# Altium project ATSAMR34 v.1.1.PrjPcb
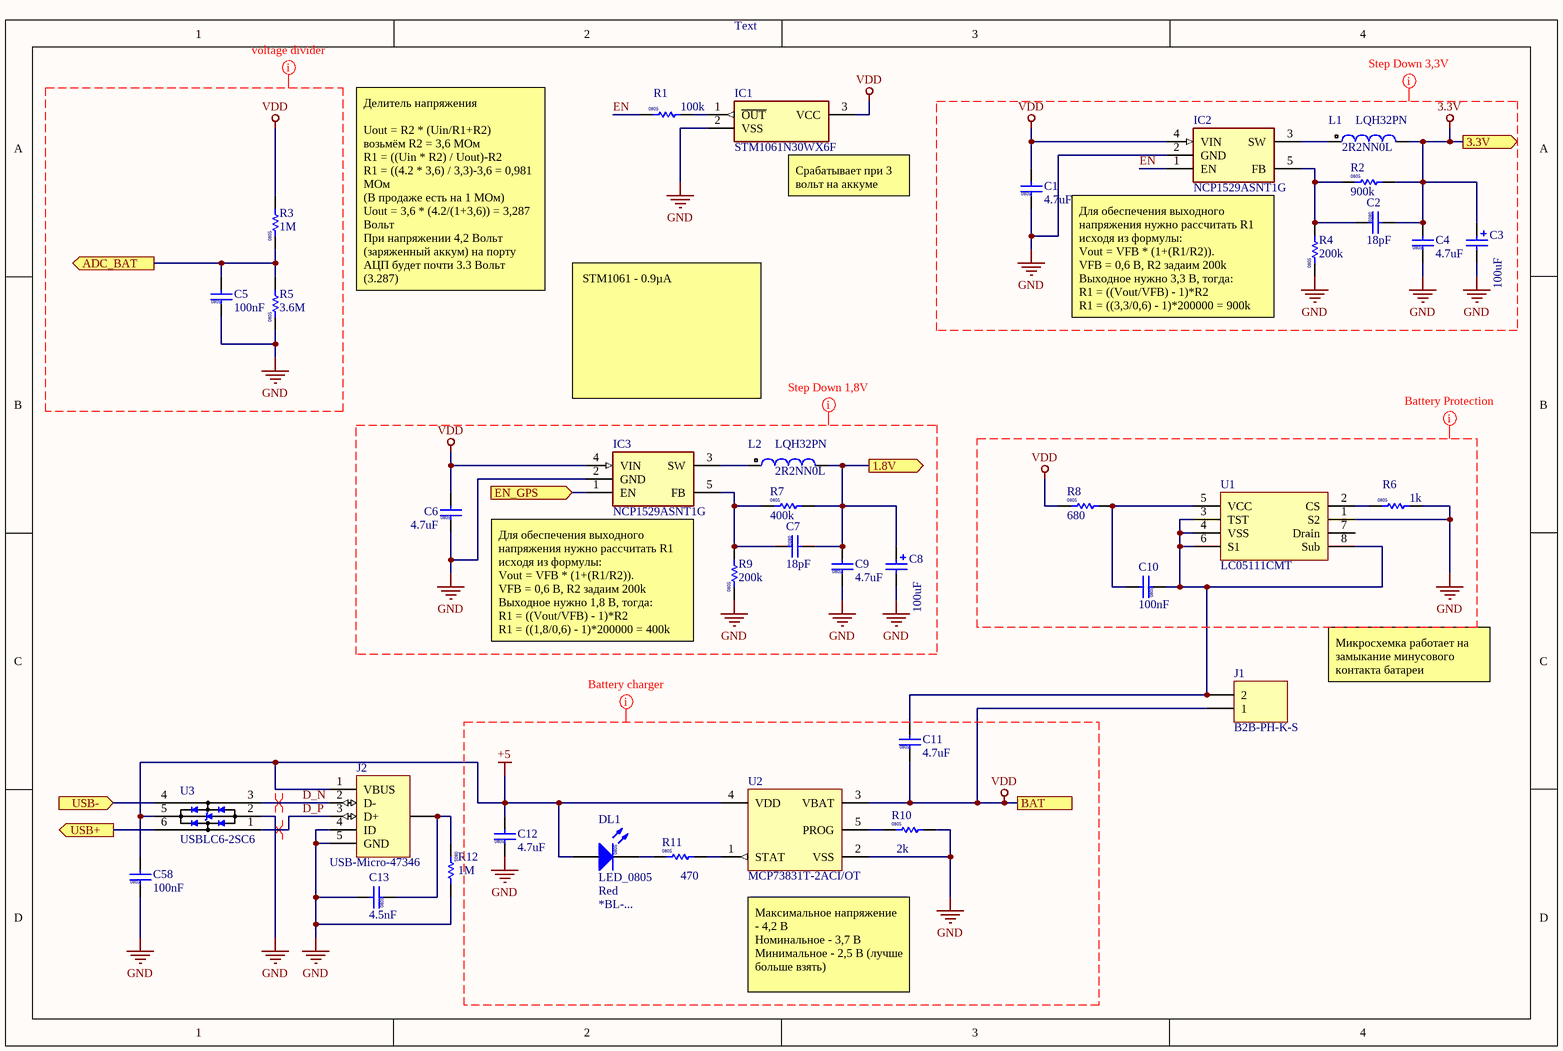
[diagram p0: Battery_Control.SchDoc]
3 sheets, 137 parts. Net scope: flat (ports and power ports of the same name join across sheets).
Board file: Lora_Geiger_PCB.PcbDoc
Sheets:
  Battery_Control.SchDoc
  MCU_RF.SchDoc
  Geiger_Pwr_LM3478.SchDoc

## Sheet Battery_Control.SchDoc
size A4

### Parts
C1  value 4.7uF  [CAPC2012-0805M]  (hidden comment: CAPC_0805)
C2  value 18pF  [CAPC2012-0805M]  (hidden comment: CAPC_0805)
C3  value 100uF  [ECAPC_0505]  (hidden comment: ECAPC_0505)
C4  value 4.7uF  [CAPC2012-0805M]  (hidden comment: CAPC_0805)
C5  value 100nF  [CAPC2012-0805M]  (hidden comment: CAPC_0805)
C6  value 4.7uF  [CAPC2012-0805M]  (hidden comment: CAPC_0805)
C7  value 18pF  [CAPC2012-0805M]  (hidden comment: CAPC_0805)
C8  value 100uF  [ECAPC_0505]  (hidden comment: ECAPC_0505)
C9  value 4.7uF  [CAPC2012-0805M]  (hidden comment: CAPC_0805)
C10  value 100nF  [CAPC2012-0805M]  (hidden comment: CAPC_0805)
C11  value 4.7uF  [CAPC2012-0805M]  (hidden comment: CAPC_0805)
C12  value 4.7uF  [CAPC2012-0805M]  (hidden comment: CAPC_0805)
C13  value 4.5nF  [CAPC2012-0805M]  (hidden comment: CAPC_0805)
C58  value 100nF  [CAPC2012-0805M]  (hidden comment: CAPC_0805)
DL1  LED_0805  Color: Red  Part number: *BL-...  [DIODEC2012-0805]
IC1  STM1061N30WX6F  [SOT103P237X112-3N]
IC2  NCP1529ASNT1G  [SOT95P275X110-5N]
IC3  NCP1529ASNT1G  [SOT95P275X110-5N]
J1  B2B-PH-K-S  [B2B-PH-K-S]
J2  USB-Micro-47346  [USB_micro_B]
L1  LQH32PN  value 2R2NN0L  [LQH32PN_N]
L2  LQH32PN  value 2R2NN0L  [LQH32PN_N]
R1  value 100k  [RESC2012-0805M]  (hidden comment: RESC_0805)
R2  value 900k  [RESC2012-0805M]  (hidden comment: RESC_0805)
R3  value 1M  [RESC2012-0805M]  (hidden comment: RESC_0805)
R4  value 200k  [RESC2012-0805M]  (hidden comment: RESC_0805)
R5  value 3.6M  [RESC2012-0805M]  (hidden comment: RESC_0805)
R6  value 1k  [RESC2012-0805M]  (hidden comment: RESC_0805)
R7  value 400k  [RESC2012-0805M]  (hidden comment: RESC_0805)
R8  value 680  [RESC2012-0805M]  (hidden comment: RESC_0805)
R9  value 200k  [RESC2012-0805M]  (hidden comment: RESC_0805)
R10  value 2k  [RESC2012-0805M]  (hidden comment: RESC_0805)
R11  value 470  [RESC2012-0805M]  (hidden comment: RESC_0805)
R12  value 1M  [RESC2012-0805M]  (hidden comment: RESC_0805)
U1  LC05111CMT  [WDFN6 2.6x4.0, 0.65P]
U2  MCP73831T-2ACI/OT  [SOT-23-OT5_N]
U3  USBLC6-2SC6  [SOT23-6L_ST]

### Ports
1.8V (out), 3.3V (out), ADC_BAT (out), BAT, EN_GPS (in), USB+ (out), USB- (in)

### Nets
3.3V: C2.2 C3.1 C4.2 L1.2 R2.2 ; port 3.3V
+5: C12.2 C58.2 DL1.1(A) J2.1(VBUS) U2.4(VDD) U3.5(Vbus)
GND: C1.1 C3.2 C4.1 C5.1 C6.1 C8.2 C9.1 C12.1 C13.2 C58.1 IC1.2(VSS) IC2.2(GND) IC3.2(GND) J2.4(ID) J2.5(GND) R4.1 R5.1 R6.2 R9.1 R10.2 R12.2 U1.1(S2) U2.2(VSS) U3.2(GND)
VDD: C1.2 C6.2 C11.1 IC1.3(VCC) IC2.4(VIN) IC3.4(VIN) J1.1 R3.2 R8.1 U2.3(VBAT) ; port BAT
D_N: J2.2(D-) U3.3(IO2)
D_P: J2.3(D+) U3.1(IO1)
EN: IC2.1(EN) R1.1
USB_N: U3.4(IO2) ; port USB-
USB_P: U3.6(IO1) ; port USB+
NetC2_1: C2.1 IC2.5(FB) R2.1 R4.2
NetC5_2: C5.2 R3.1 R5.2 ; port ADC_BAT
NetC7_1: C7.1 IC3.5(FB) R7.1 R9.2
NetC7_2: C7.2 C8.1 C9.2 L2.2 R7.2 ; port 1.8V
NetC10_1: C10.1 C11.2 J1.2 U1.3(TST) U1.4(VSS) U1.6(S1) U1.8(Sub)
NetC10_2: C10.2 R8.2 U1.5(VCC)
NetC13_1: C13.1 J2.SHIELD(SHLD) R12.1
NetDL1_2: DL1.2(K) R11.1
NetIC1_1: IC1.1(~{OUT}) R1.2
NetIC2_3: IC2.3(SW) L1.1
NetIC3_1: IC3.1(EN) ; port EN_GPS
NetIC3_3: IC3.3(SW) L2.1
NetR6_1: R6.1 U1.2(CS)
NetR10_1: R10.1 U2.5(PROG)
NetR11_2: R11.2 U2.1(STAT)

Not connected (* = marked no-connect by the designer): U1 7(Drain)

### Layout directives
mark named voltage divider: GND, VDD
net class POWER: 3.3V, +5, EN, GND, VDD
differential pair: D_N, D_P

### Notes on the sheet
- Text
- (near IC1) Срабатывает при 3 вольт на аккуме
- Делитель напряжения
  Uout = R2 * (Uin/R1+R2)
  возьмём R2 = 3,6 МОм
  R1 = ((Uin * R2) / Uout)-R2
  R1 = ((4.2 * 3,6) / 3,3)-3,6 = 0,981 МОм
  (В продаже есть на 1 МОм)
  Uout = 3,6 * (4.2/(1+3,6)) = 3,287 Вольт
  При напряжении 4,2 Вольт (заряженный аккум) на порту АЦП будет почти 3.3 Вольт (3.287)
- Для обеспечения выходного напряжения нужно рассчитать R1 исходя из формулы:
  Vout = VFB * (1+(R1/R2)).
  VFB = 0,6 В, R2 задаим 200k
  Выходное нужно 3,3 В, тогда:
  R1 = ((Vout/VFB) - 1)*R2
  R1 = ((3,3/0,6) - 1)*200000 = 900k
- STM1061 - 0.9µA
- Для обеспечения выходного напряжения нужно рассчитать R1 исходя из формулы:
  Vout = VFB * (1+(R1/R2)).
  VFB = 0,6 В, R2 задаим 200k
  Выходное нужно 1,8 В, тогда:
  R1 = ((Vout/VFB) - 1)*R2
  R1 = ((1,8/0,6) - 1)*200000 = 400k
- Микросхемка работает на замыкание минусового контакта батареи
- (near U2) Максимальное напряжение - 4,2 В
  Номинальное - 3,7 В
  Минимальное - 2,5 В (лучше больше взять)
- (in symbol CAPC_0805) 0805
- (in symbol LED_0805) 0805
- (in symbol RESC_0805) 0805

### Library data of the parts
C1 C2 C4-C7 C9-C13 C58 = CAPC_0805: Capacitor 0805
C3 C8 = ECAPC_0505: Electrolytic Capacitor SMD 0505; Published: 8-Jun-2000; LatestRevisionDate: 17-Jul-2002; LatestRevisionNote: Re-released for DXP Platform.; PackageReference: C0805; Publisher: Altium Limited
DL1 = LED_0805: LED 0805
IC1 = STM1061N34WX6F: Integrated Circuit; Manufacturer_Name: STMicroelectronics; Allied_Number: 70014045; Datasheet Link: http://www.st.com/web/en/resource/technical/document/datasheet/CD00065467.pdf; Height: 1.12mm; Manufacturer_Part_Number: STM1061N34WX6F; Mouser Part Number: 511-STM1061N34WX6F; Mouser Price/Stock: https://www.mouser.com/Search/Refine.aspx?Keyword=511-STM1061N34WX6F; RS Part Number: 6864784; RS Price/Stock: https://uk.rs-online.com/web/p/products/6864784; Allied Price/Stock: http://www.alliedelec.com/stmicroelectronics-stm1061n34wx6f/70014045/
IC2 IC3 = NCP1529ASNT1G: Integrated Circuit; Manufacturer_Name: ON Semiconductor; Allied_Number: 70466941; Datasheet Link: http://www.onsemi.com/pub/Collateral/NCP1529-D.PDF; Height: 1.1mm; Manufacturer_Part_Number: NCP1529ASNT1G; Mouser Part Number: 863-NCP1529ASNT1G; Mouser Price/Stock: https://www.mouser.com/Search/Refine.aspx?Keyword=863-NCP1529ASNT1G; RS Part Number: 8023161P; RS Price/Stock: http://uk.rs-online.com/web/p/products/8023161P; Allied Price/Stock: http://www.alliedelec.com/on-semiconductor-ncp1529asnt1g/70466941/
J1 = B2B-PH-K-S: B2B-PH-K-S 2.0 mm pitrch header PCB straight
J2 = USB-Micro-47346: Micro USB B Molex 47346; ComponentLink1Description: Manufacturer Link; ComponentLink1URL: http://www.tycoelectronics.com/
L1 L2 = LQH32PN: LQH32PN Murata inductor; Code_IEC: 1005; Published: 8-Jun-2000; LatestRevisionDate: 17-Jul-2002; LatestRevisionNote: Re-released for DXP Platform.; PackageReference: 0402-A; Publisher: Altium Limited; Code_JEITA: 0402
R1-R12 = RESC_0805: Resistor 0805
U1 = LC05111CMT: Защита Li-On от перезаряда переразряда; Rule: UNIONINDEX=0|RULEKIND=Width|NETSCOPE=AnyNet|LAYERKIND=SameLayer|NAME=Schematic Width Constraint|MAXLIMIT=20mil|MINLIMIT=10mil|PREFEREDWIDTH=15mil|UNIT=Imperial; ClassName: Small
U2 = MCP73831T-2ACI/OT: Miniature Single-Cell, Fully Integrated Li-Ion, Li-Polymer Charge Management Controller, 4.2V, 5-Pin SOT-23, Industrial Temperature, Tape and Reel; Manufacturer: Microchip; DatasheetVersion: revE, Sep-2008; PackageVersion: revBB, Aug-2009; PackageReference: SOT-23-OT5; PackageDescription: 5-Lead Plastic Small Outline Transistor (OT) [SOT-23]; Supplier 1: Digi-Key; Supplier Part Number 1: MCP73831T-2ACI/OTTR-ND; Supplier 2: Digi-Key; Supplier Part Number 2: MCP73831T-2ACI/OTCT-ND; Supplier 3: Digi-Key; Supplier Part Number 3: MCP73831T-2ACI/OTDKR-ND; Supplier 4: Farnell; Supplier Part Number 4: 1332158; Supplier 5: Farnell; Supplier Part Number 5: 1332158RL; Supplier 6: Newark; Supplier Part Number 6: 56K7045; Supplier 7: Mouser; Supplier Part Number 7: 579-MCP73831T-2ACIOT; Mounting Technology: Surface Mount; Code_IPC: SOT23-5; PartNumber: MCP73831T-2ACI/OT; ComponentLink1Description: Manufacturer URL; ComponentLink1URL: http://www.microchip.com/; ComponentLink2Description: Datasheet; ComponentLink2URL: http://ww1.microchip.com/downloads/en/DeviceDoc/21984e.pdf; ComponentLink3Description: Package Specification; ComponentLink3URL: http://www.microchip.com/stellent/groups/techpub_sg/documents/packagingspec/en012702.pdf
U3 = USBLC6-2SC6: USBLC6-2SC6 ESD protection diodes assembly

## Sheet MCU_RF.SchDoc
size Tabloid
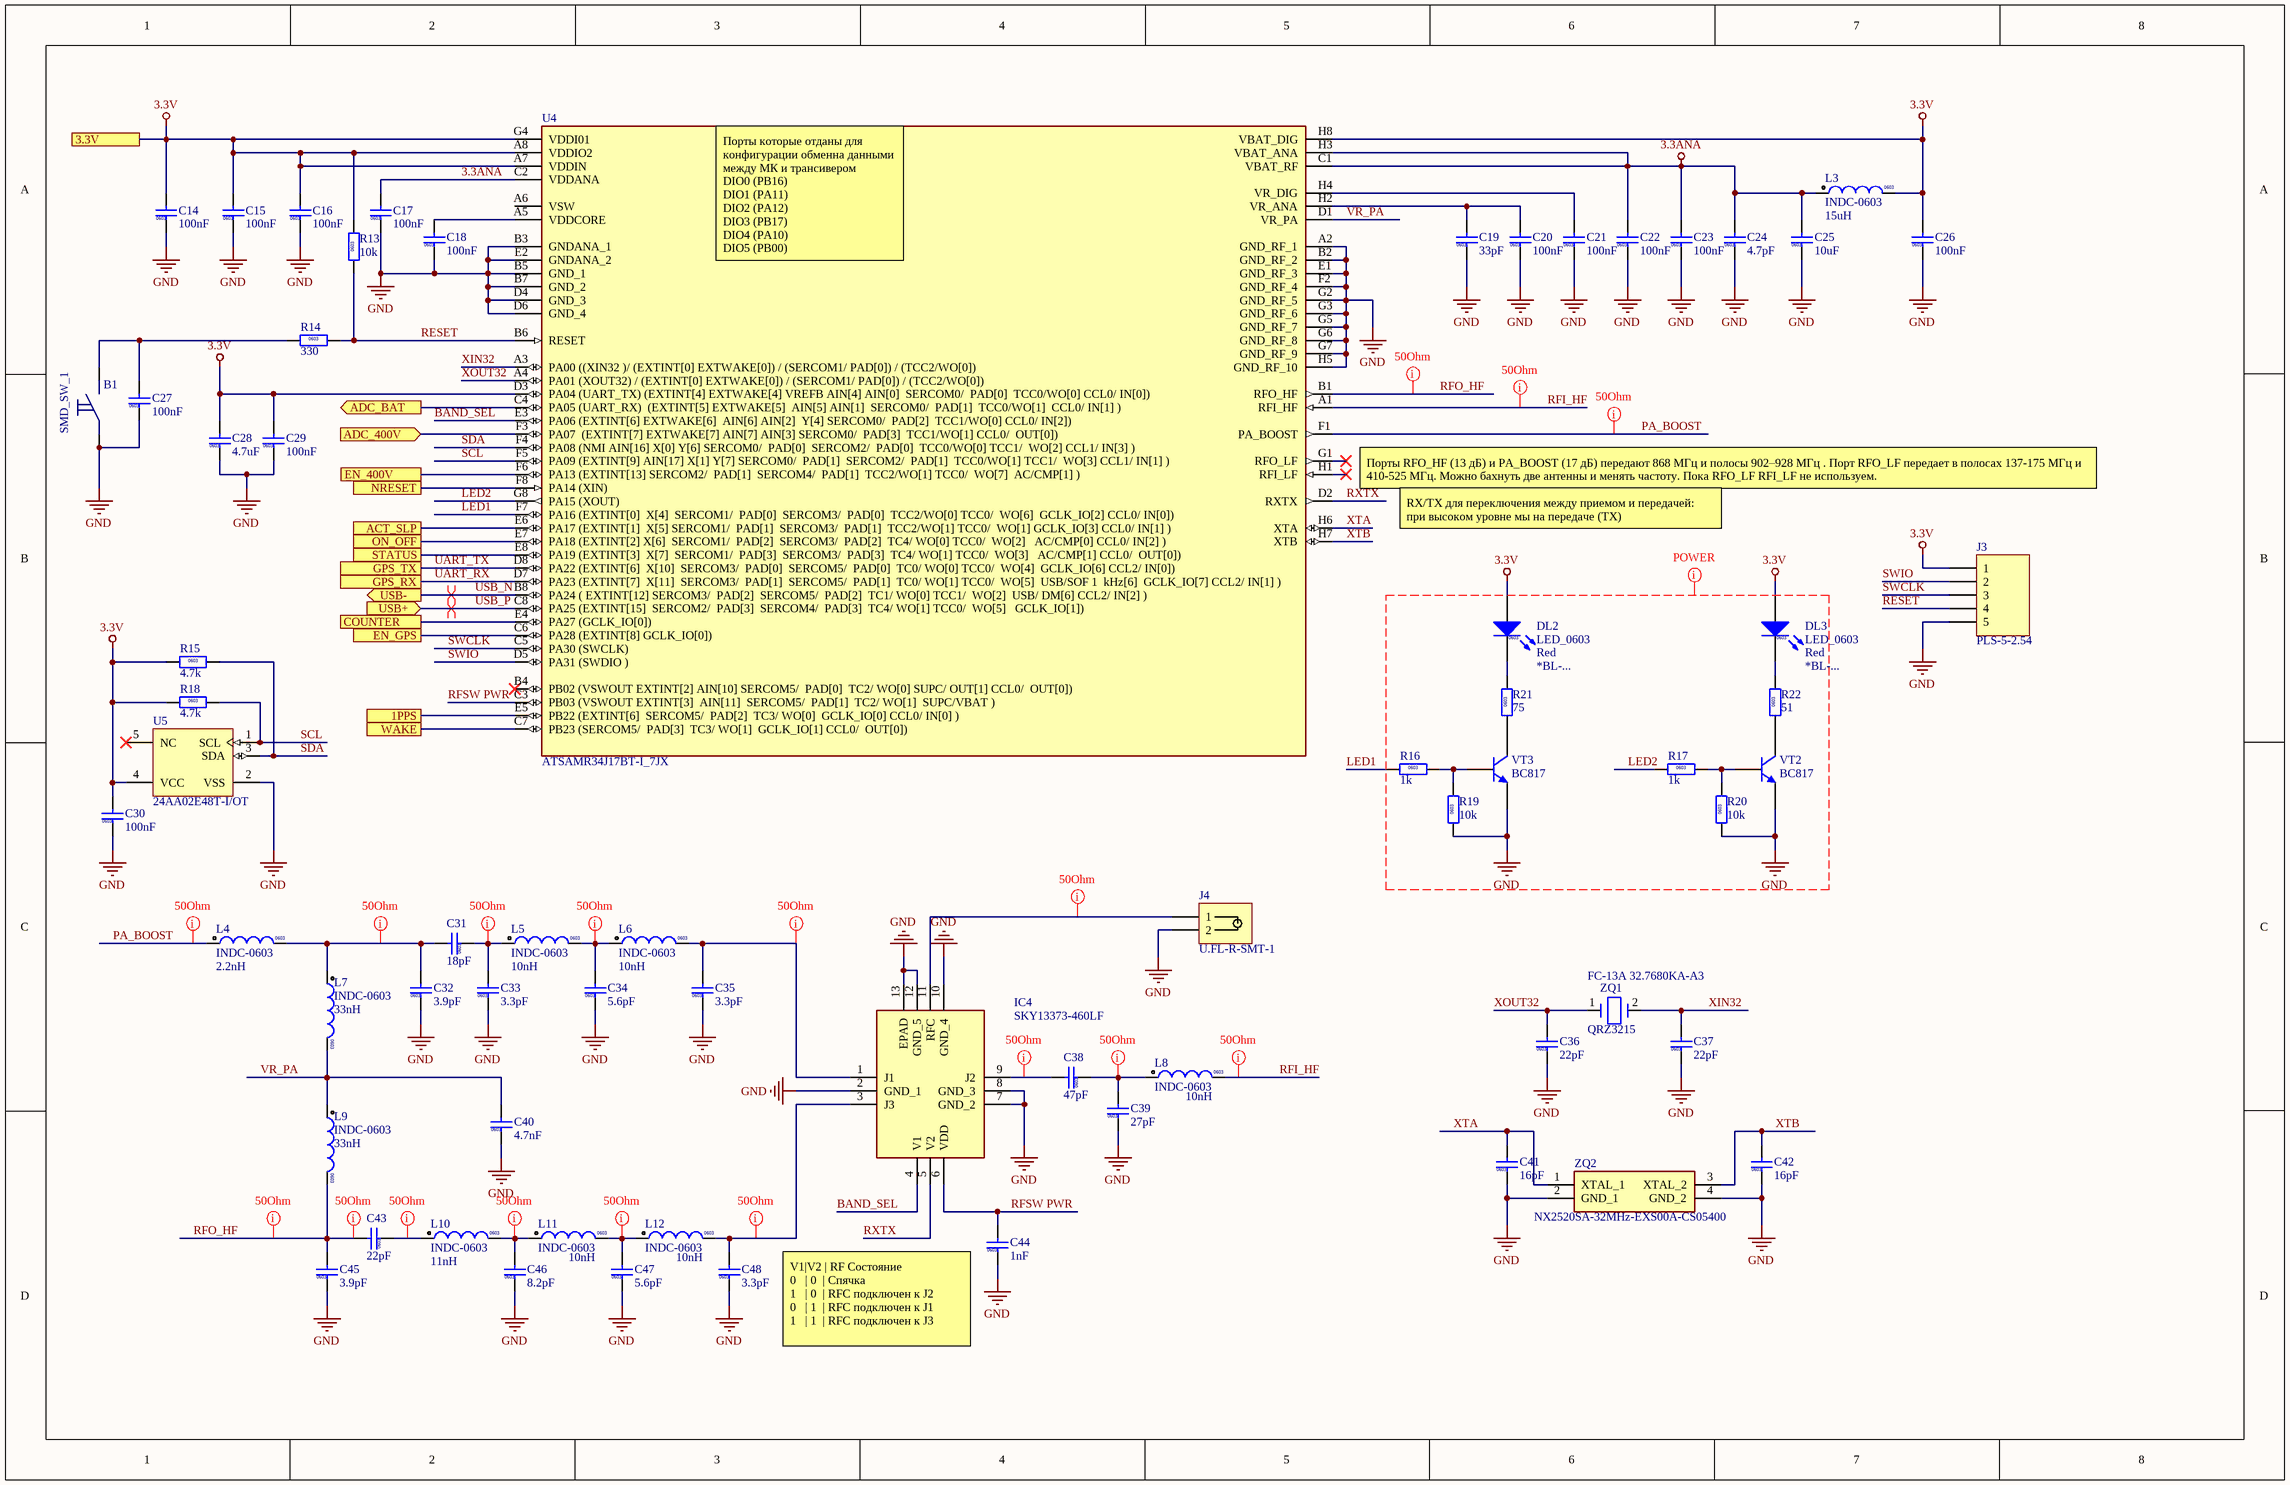
[diagram p1: MCU_RF.SchDoc]

### Parts
B1  SMD_SW_1  [SMD_SW_1]
C14  value 100nF  [CAPC1608-0603L]  (hidden comment: CAPC_0603)
C15  value 100nF  [CAPC1608-0603L]  (hidden comment: CAPC_0603)
C16  value 100nF  [CAPC1608-0603L]  (hidden comment: CAPC_0603)
C17  value 100nF  [CAPC1608-0603L]  (hidden comment: CAPC_0603)
C18  value 100nF  [CAPC1608-0603L]  (hidden comment: CAPC_0603)
C19  value 33pF  [CAPC1608-0603L]  (hidden comment: CAPC_0603)
C20  value 100nF  [CAPC1608-0603L]  (hidden comment: CAPC_0603)
C21  value 100nF  [CAPC1608-0603L]  (hidden comment: CAPC_0603)
C22  value 100nF  [CAPC1608-0603L]  (hidden comment: CAPC_0603)
C23  value 100nF  [CAPC1608-0603L]  (hidden comment: CAPC_0603)
C24  value 4.7pF  [CAPC1608-0603L]  (hidden comment: CAPC_0603)
C25  value 10uF  [CAPC1608-0603L]  (hidden comment: CAPC_0603)
C26  value 100nF  [CAPC1608-0603L]  (hidden comment: CAPC_0603)
C27  value 100nF  [CAPC1608-0603M]  (hidden comment: CAPC_0603)
C28  value 4.7uF  [CAPC1608-0603L]  (hidden comment: CAPC_0603)
C29  value 100nF  [CAPC1608-0603L]  (hidden comment: CAPC_0603)
C30  value 100nF  [CAPC1608-0603L]  (hidden comment: CAPC_0603)
C31  value 18pF  [CAPC1608-0603L]  (hidden comment: CAPC_0603)
C32  value 3.9pF  [CAPC1608-0603L]  (hidden comment: CAPC_0603)
C33  value 3.3pF  [CAPC1608-0603L]  (hidden comment: CAPC_0603)
C34  value 5.6pF  [CAPC1608-0603L]  (hidden comment: CAPC_0603)
C35  value 3.3pF  [CAPC1608-0603L]  (hidden comment: CAPC_0603)
C36  value 22pF  [CAPC1608-0603L]  (hidden comment: CAPC_0603)
C37  value 22pF  [CAPC1608-0603L]  (hidden comment: CAPC_0603)
C38  value 47pF  [CAPC1608-0603L]  (hidden comment: CAPC_0603)
C39  value 27pF  [CAPC1608-0603L]  (hidden comment: CAPC_0603)
C40  value 4.7nF  [CAPC1608-0603L]  (hidden comment: CAPC_0603)
C41  value 16pF  [CAPC1608-0603L]  (hidden comment: CAPC_0603)
C42  value 16pF  [CAPC1608-0603L]  (hidden comment: CAPC_0603)
C43  value 22pF  [CAPC1608-0603L]  (hidden comment: CAPC_0603)
C44  value 1nF  [CAPC1608-0603L]  (hidden comment: CAPC_0603)
C45  value 3.9pF  [CAPC1608-0603L]  (hidden comment: CAPC_0603)
C46  value 8.2pF  [CAPC1608-0603L]  (hidden comment: CAPC_0603)
C47  value 5.6pF  [CAPC1608-0603L]  (hidden comment: CAPC_0603)
C48  value 3.3pF  [CAPC1608-0603L]  (hidden comment: CAPC_0603)
DL2  LED_0603  Color: Red  Part number: *BL-...  [DIODEC1608-0603]
DL3  LED_0603  Color: Red  Part number: *BL-...  [DIODEC1608-0603]
IC4  SKY13373-460LF  [QFN50P200X200X60-13N-D]
J3  PLS-5-2.54  [PLS-5-2.54]
J4  U.FL-R-SMT-1  [HIROSE_U.FL-R-SMT-1(10)]
L3  INDC-0603  value 15uH  [INDC1608AL]
L4  INDC-0603  value 2.2nH  [INDC1608AL]
L5  INDC-0603  value 10nH  [INDC1608AL]
L6  INDC-0603  value 10nH  [INDC1608AL]
L7  INDC-0603  value 33nH  [INDC1608AL]
L8  INDC-0603  value 10nH  [INDC1608AL]
L9  INDC-0603  value 33nH  [INDC1608AL]
L10  INDC-0603  value 11nH  [INDC1608AL]
L11  INDC-0603  value 10nH  [INDC1608AL]
L12  INDC-0603  value 10nH  [INDC1608AL]
R13  value 10k  [RESC1608-0603M]  (hidden comment: RESC_0603_R)
R14  value 330  [RESC1608-0603M]  (hidden comment: RESC_0603_R)
R15  value 4.7k  [RESC1608-0603M]  (hidden comment: RESC_0603_R)
R16  value 1k  [RESC1608-0603M]  (hidden comment: RESC_0603_R)
R17  value 1k  [RESC1608-0603M]  (hidden comment: RESC_0603_R)
R18  value 4.7k  [RESC1608-0603M]  (hidden comment: RESC_0603_R)
R19  value 10k  [RESC1608-0603M]  (hidden comment: RESC_0603_R)
R20  value 10k  [RESC1608-0603M]  (hidden comment: RESC_0603_R)
R21  value 75  [RESC1608-0603M]  (hidden comment: RESC_0603_R)
R22  value 51  [RESC1608-0603M]  (hidden comment: RESC_0603_R)
U4  ATSAMR34J17BT-I_7JX  [BGA64C65P8X8_600X600X120]
U5  24AA02E48T-I/OT  [SOT-23-OT5_N]
VT2  BC817  [SOT23-3M]
VT3  BC817  [SOT23-3M]
ZQ1  QRZ3215  value FC-13A 32.7680KA-A3  [QRZ3215_L]
ZQ2  NX2520SA-32MHz-EXS00A-CS05400  [NX2520SA192MHzEXS00ACS05400]

### Ports
1PPS, 3.3V, ACT_SLP, ADC_400V (in), ADC_BAT (out), COUNTER, EN_400V, EN_GPS, GPS_RX, GPS_TX, NRESET, ON_OFF, STATUS, USB+ (in), USB- (out), WAKE

### Nets
3.3ANA: C17.2 C22.2 C23.2 C24.2 C25.2 L3.1 U4.C1(VBAT_RF) U4.C2(VDDANA) U4.H3(VBAT_ANA)
3.3V: C14.2 C15.2 C16.2 C26.2 C28.2 C29.2 C30.2 DL2.1(A) DL3.1(A) J3.1 L3.2 R13.2 R15.1 R18.1 U4.A7(VDDIN) U4.A8(VDDIO2) U4.D3(PA04_(UART_TX)_(EXTINT[4]_EXTWAKE[4]_VREFB_AIN[4]_AIN[0]__SERCOM0/__PAD[0]__TCC0/WO[0]_CCL0/_IN[0])) U4.G4(VDDI01) U4.H8(VBAT_DIG) U5.4(VCC) ; port 3.3V
GND: B1.1 C14.1 C15.1 C16.1 C17.1 C18.1 C19.1 C20.1 C21.1 C22.1 C23.1 C24.1 C25.1 C26.1 C27.1 C28.1 C29.1 C30.1 C32.1 C33.1 C34.1 C35.1 C36.1 C37.1 C39.1 C40.1 C41.1 C42.1 C44.1 C45.1 C46.1 C47.1 C48.1 IC4.2(GND_1) IC4.7(GND_2) IC4.8(GND_3) IC4.10(GND_4) IC4.12(GND_5) IC4.13(EPAD) J3.5 J4.2 R19.1 R20.1 U4.A2(GND_RF_1) U4.B2(GND_RF_2) U4.B3(GNDANA_1) U4.B5(GND_1) U4.B7(GND_2) U4.D4(GND_3) U4.D6(GND_4) U4.E1(GND_RF_3) U4.E2(GNDANA_2) U4.F2(GND_RF_4) U4.G2(GND_RF_5) U4.G3(GND_RF_6) U4.G5(GND_RF_7) U4.G6(GND_RF_8) U4.G7(GND_RF_9) U4.H5(GND_RF_10) U5.2(VSS) VT2.2(E) VT3.2(E) ZQ2.2(GND_1) ZQ2.4(GND_2)
BAND_SEL: IC4.4(V1) U4.E3(PA06_(EXTINT[6]_EXTWAKE[6]__AIN[6]_AIN[2]__Y[4]_SERCOM0/__PAD[2]__TCC1/WO[0]_CCL0/_IN[2]))
LED1: R16.1 U4.F7(PA16_(EXTINT[0]__X[4]__SERCOM1/__PAD[0]__SERCOM3/__PAD[0]__TCC2/WO[0]_TCC0/__WO[6]__GCLK_IO[2]_CCL0/_IN[0]))
LED2: R17.1 U4.G8(PA15_(XOUT))
PA_BOOST: L4.1 U4.F1(PA_BOOST)
RESET: J3.4 R13.1 R14.2 U4.B6(RESET)
RFI_HF: L8.2 U4.A1(RFI_HF)
RFO_HF: C43.2 C45.2 L9.2 U4.B1(RFO_HF)
RFSW PWR: C44.2 IC4.6(VDD) U4.C3(PB03_(VSWOUT_EXTINT[3]__AIN[11]__SERCOM5/__PAD[1]__TC2/_WO[1]__SUPC/VBAT_))
RXTX: IC4.5(V2) U4.D2(RXTX)
SCL: R18.2 U4.F5(PA09_(EXTINT[9]_AIN[17]_X[1]_Y[7]_SERCOM0/__PAD[1]__SERCOM2/__PAD[1]__TCC0/WO[1]_TCC1/__WO[3]_CCL1/_IN[1]_)) U5.1(SCL)
SDA: R15.2 U4.F4(PA08_(NMI_AIN[16]_X[0]_Y[6]_SERCOM0/__PAD[0]__SERCOM2/__PAD[0]__TCC0/WO[0]_TCC1/__WO[2]_CCL1/_IN[3]_)) U5.3(SDA)
SWCLK: J3.3 U4.C5(PA30_(SWCLK))
SWIO: J3.2 U4.D5(PA31_(SWDIO_))
UART_RX: U4.D7(PA23_(EXTINT[7]__X[11]__SERCOM3/__PAD[1]__SERCOM5/__PAD[1]__TC0/_WO[1]_TCC0/__WO[5]__USB/SOF_1__kHz[6]__GCLK_IO[7]_CCL2/_IN[1]_)) ; port GPS_RX
UART_TX: U4.D8(PA22_(EXTINT[6]__X[10]__SERCOM3/__PAD[0]__SERCOM5/__PAD[0]__TC0/_WO[0]_TCC0/__WO[4]__GCLK_IO[6]_CCL2/_IN[0])) ; port GPS_TX
USB_N: U4.B8(PA24_(_EXTINT[12]_SERCOM3/__PAD[2]__SERCOM5/__PAD[2]__TC1/_WO[0]_TCC1/__WO[2]__USB/_DM[6]_CCL2/_IN[2]_)) ; port USB-
USB_P: U4.C8(PA25_(EXTINT[15]__SERCOM2/__PAD[3]__SERCOM4/__PAD[3]__TC4/_WO[1]_TCC0/__WO[5]___GCLK_IO[1])) ; port USB+
VR_PA: C40.2 L7.2 L9.1 U4.D1(VR_PA)
XIN32: C37.2 U4.A3(PA00_((XIN32_)/_(EXTINT[0]_EXTWAKE[0])_/_(SERCOM1/_PAD[0])_/_(TCC2/WO[0])) ZQ1.2
XOUT32: C36.2 U4.A4(PA01_(XOUT32)_/_(EXTINT[0]_EXTWAKE[0])_/_(SERCOM1/_PAD[0])_/_(TCC2/WO[0])) ZQ1.1
XTA: C41.2 U4.H6(XTA) ZQ2.1(XTAL_1)
XTB: C42.2 U4.H7(XTB) ZQ2.3(XTAL_2)
NetB1_2: B1.2 C27.2 R14.1
NetC5_2: U4.C4(PA05_(UART_RX)__(EXTINT[5]_EXTWAKE[5]__AIN[5]_AIN[1]__SERCOM0/__PAD[1]__TCC0/WO[1]__CCL0/_IN[1]_)) ; port ADC_BAT
NetC18_2: C18.2 U4.A5(VDDCORE)
NetC19_2: C19.2 C20.2 U4.H2(VR_ANA)
NetC21_2: C21.2 U4.H4(VR_DIG)
NetC31_1: C31.1 C33.2 L5.1
NetC31_2: C31.2 C32.2 L4.2 L7.1
NetC34_2: C34.2 L5.2 L6.1
NetC35_2: C35.2 IC4.1(J1) L6.2
NetC38_1: C38.1 C39.2 L8.1
NetC38_2: C38.2 IC4.9(J2)
NetC43_1: C43.1 L10.1
NetC46_2: C46.2 L10.2 L11.1
NetC47_2: C47.2 L11.2 L12.1
NetC48_2: C48.2 IC4.3(J3) L12.2
NetDL2_2: DL2.2(K) R21.2
NetDL3_2: DL3.2(K) R22.2
NetIC3_1: U4.C6(PA28_(EXTINT[8]_GCLK_IO[0])) ; port EN_GPS
NetIC4_11: IC4.11(RFC) J4.1
NetJMP1_1: U4.F3(PA07__(EXTINT[7]_EXTWAKE[7]_AIN[7]_AIN[3]_SERCOM0/__PAD[3]__TCC1/WO[1]_CCL0/__OUT[0])) ; port ADC_400V
NetPS1_7: U4.F6(PA13_(EXTINT[13]_SERCOM2/__PAD[1]__SERCOM4/__PAD[1]__TCC2/WO[1]_TCC0/__WO[7]__AC/CMP[1]_)) ; port EN_400V
NetQ3_3: U4.E4(PA27_(GCLK_IO[0])) ; port COUNTER
NetR16_2: R16.2 R19.2 VT3.1(B)
NetR17_2: R17.2 R20.2 VT2.1(B)
NetR21_1: R21.1 VT3.3(C)
NetR22_1: R22.1 VT2.3(C)
NetU4_C7: U4.C7(PB23_(SERCOM5/__PAD[3]__TC3/_WO[1]__GCLK_IO[1]_CCL0/__OUT[0])) ; port WAKE
NetU4_E5: U4.E5(PB22_(EXTINT[6]__SERCOM5/__PAD[2]__TC3/_WO[0]__GCLK_IO[0]_CCL0/_IN[0]_)) ; port 1PPS
NetU4_E6: U4.E6(PA17_(EXTINT[1]__X[5]_SERCOM1/__PAD[1]__SERCOM3/__PAD[1]__TCC2/WO[1]_TCC0/__WO[1]_GCLK_IO[3]_CCL0/_IN[1]_)) ; port ACT_SLP
NetU4_E7: U4.E7(PA18_(EXTINT[2]_X[6]__SERCOM1/__PAD[2]__SERCOM3/__PAD[2]__TC4/_WO[0]_TCC0/__WO[2]___AC/CMP[0]_CCL0/_IN[2]_)) ; port ON_OFF
NetU4_E8: U4.E8(PA19_(EXTINT[3]__X[7]__SERCOM1/__PAD[3]__SERCOM3/__PAD[3]__TC4/_WO[1]_TCC0/__WO[3]___AC/CMP[1]_CCL0/__OUT[0])) ; port STATUS
NetU4_F8: U4.F8(PA14_(XIN)) ; port NRESET

Not connected (* = marked no-connect by the designer): U4 A6(VSW) B4(PB02_(VSWOUT_EXTINT[2]_AIN[10]_SERCOM5/__PAD[0]__TC2/_WO[0]_SUPC/_OUT[1]_CCL0/__OUT[0]))* G1(RFO_LF)* H1(RFI_LF)*; U5 5(NC)*

### Layout directives
net class 50Ohm: NetC31_1, NetC31_2, NetC34_2, NetC35_2, NetC38_1, NetC38_2, NetC43_1, NetC46_2, NetC47_2, NetC48_2, NetIC4_11, PA_BOOST, RFI_HF, RFO_HF
net class POWER: GND, LED2
differential pair: USB_N, USB_P

### Notes on the sheet
- (near U4) Порты которые отданы для конфигурации обменна данными между МК и трансивером
  DIO0 (PB16)
  DIO1 (PA11)
  DIO2 (PA12)
  DIO3 (PB17)
  DIO4 (PA10)
  DIO5 (PB00)
- Порты RFO_HF (13 дБ) и PA_BOOST (17 дБ) передают 868 МГц и полосы 902–928 МГц . Порт RFO_LF передает в полосах 137-175 МГц и 410-525 МГц. Можно бахнуть две антенны и менять частоту. Пока RFO_LF RFI_LF не используем.
- RX/TX для переключения между приемом и передачей: при высоком уровне мы на передаче (TX)
- (near C44) V1|V2 | RF Состояние
  0   | 0  | Спячка
  1   | 0  | RFC подключен к J2
  0   | 1  | RFC подключен к J1
  1   | 1  | RFC подключен к J3
- Title
- Size:
- Date:
- Tabloid
- Number:
- Time:
- Revision:
- Sheet
- of
- File:
- (in symbol CAPC_0603) 0603
- (in symbol INDC-0603) 0603
- (in symbol LED_0603) 0603
- (in symbol RESC_0603_R) 0603

### Library data of the parts
B1 = SMD_SW_1: SMD Switch
C14-C48 = CAPC_0603: Capacitor 0603
DL2 DL3 = LED_0603: LED 0603
IC4 = SKY13373-460LF: Integrated Circuit; Manufacturer_Name: Skyworks; Datasheet Link: http://www.skyworksinc.com/uploads/documents/SKY13373_460LF_201264N.pdf; Height: 0.6mm; Manufacturer_Part_Number: SKY13373-460LF; Mouser Part Number: 873-SKY13373-460LF; Mouser Price/Stock: https://www.mouser.com/Search/Refine.aspx?Keyword=873-SKY13373-460LF
J3 = PLS-5-2.54: PLS-2-2.54; LatestRevisionDate: 17-Jul-2002; LatestRevisionNote: Re-released for DXP Platform.; Publisher: Altium Limited
J4 = U.FL-R-SMT-1: Hirose U.FL-R-SMT-1 HF connector
L3-L12 = INDC-0603: Chip Inductor, Body Body 1.6x0.8mm
R13-R22 = RESC_0603_R: Resistor 0603
U4 = ATSAMR34J17BT-I_7JX: Integrated Circuit; Manufacturer_Name: Microchip; Manufacturer_Part_Number: ATSAMR34J18BT-I/7JX; Datasheet Link: https://www.mouser.com/datasheet/2/268/SAMR34-R35-Low-Power-LoRa-Sub-GHz-SiP-Data-Sheet-D-1507280.pdf; Height: 1.2mm; Mouser Part Number: 579-SAMR34J18BTI7JX; Mouser Price/Stock: https://www.mouser.com/Search/Refine.aspx?Keyword=579-SAMR34J18BTI7JX
U5 = 24AA02E48T-I/OT: 2Kbit, 400kHz, 1.7V, I2C Serial EEPROM with EUI-48 Node Identity, 5-Pin SOT-23, Industrial Temperature, Tape and Reel; Manufacturer: Microchip; DatasheetVersion: revB, Jan-2009; PackageVersion: revBB, Aug-2009; PackageReference: SOT-23-OT5; PackageDescription: 5-Lead Plastic Small Outline Transistor (OT) [SOT-23]; Supplier 1: Digi-Key; Supplier Part Number 1: 24AA02E48T-I/OTTR-ND; Supplier 2: Digi-Key; Supplier Part Number 2: 24AA02E48T-I/OTCT-ND; Supplier 3: Digi-Key; Supplier Part Number 3: 24AA02E48T-I/OTDKR-ND; Supplier 4: Farnell; Supplier Part Number 4: 1688855; Supplier 5: Farnell; Supplier Part Number 5: 1688855RL; Supplier 6: Newark; Supplier Part Number 6: 45P4895; Supplier 7: Mouser; Supplier Part Number 7: 579-24AA02E48TIOT; Mounting Technology: Surface Mount; Code_IPC: SOT23-5; PartNumber: 24AA02E48T-I/OT; ComponentLink1Description: Manufacturer URL; ComponentLink1URL: http://www.microchip.com/; ComponentLink2Description: Datasheet; ComponentLink2URL: http://ww1.microchip.com/downloads/en/DeviceDoc/22124B.pdf; ComponentLink3Description: Package Specification; ComponentLink3URL: http://www.microchip.com/stellent/groups/techpub_sg/documents/packagingspec/en012702.pdf
VT2 VT3 = BC817: BC817 NPN Transistor
ZQ1 = QRZ3215: Quartz SMD 3.2*1.5 mm body 2 pads SMD
ZQ2 = NX2520SA-19.2MHz-EXS00A-CS05400: Crystal or Oscillator; Manufacturer_Name: NDK; Datasheet Link: https://kr.mouser.com/datasheet/2/905/ndk_08142018_NX2520SA-19.200000MHZ-NBG1-1389014.pdf; Height: 0.55mm; Manufacturer_Part_Number: NX2520SA-19.2MHz-EXS00A-CS05400; Mouser Part Number: 344-NX2520SA19.2MH54; Mouser Price/Stock: https://www.mouser.com/Search/Refine.aspx?Keyword=344-NX2520SA19.2MH54

## Sheet Geiger_Pwr_LM3478.SchDoc
size A4
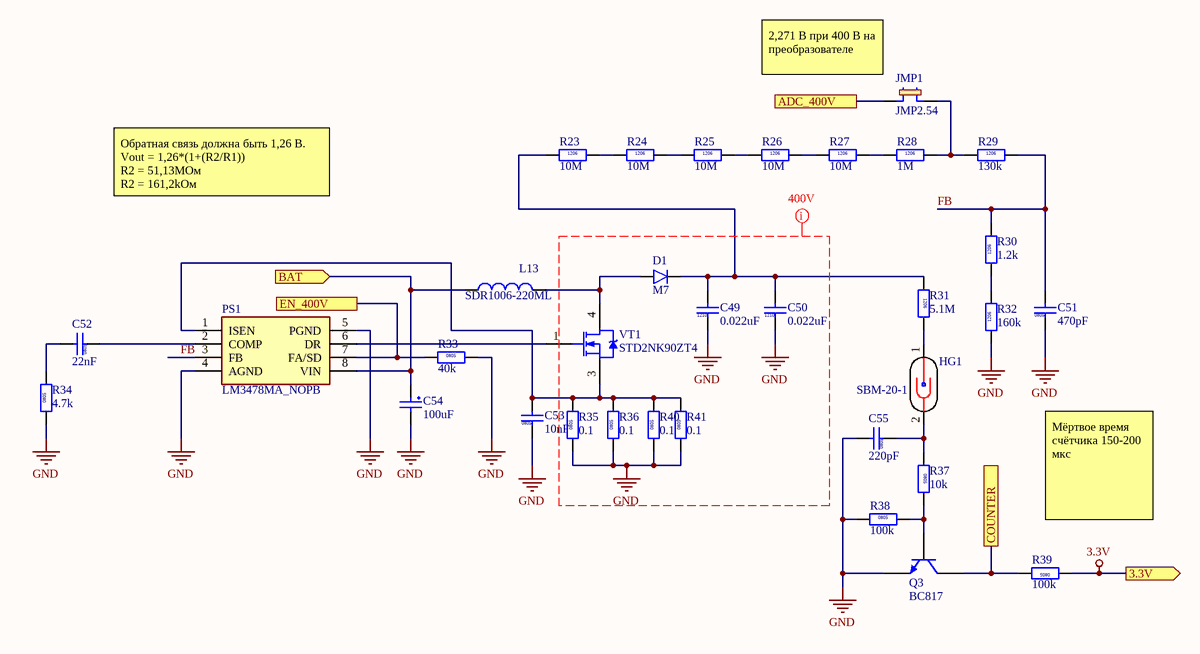
[diagram p2: Geiger_Pwr_LM3478.SchDoc]

### Parts
C49  value 0.022uF  [CAPC3225-1210L]  (hidden comment: CAPC_1210)
C50  value 0.022uF  [CAPC3225-1210L]  (hidden comment: CAPC_1210)
C51  value 470pF  [CAPC2012-0805M]  (hidden comment: CAPC_0805)
C52  value 22nF  [CAPC2012-0805M]  (hidden comment: CAPC_0805)
C53  value 10nF  [CAPC2012-0805M]  (hidden comment: CAPC_0805)
C54  value 100uF  [ECAP511]  (hidden comment: ECAP-511)
C55  value 220pF  [CAPC2012-0805M]  (hidden comment: CAPC_0805)
D1  M7  [DIOM5026X262N]
HG1  SBM-20-1  [SBM-20-1]
JMP1  JMP2.54  [JMP2.54]
L13  SDR1006-220ML  [SDR1006]
PS1  LM3478MA_NOPB  [SOIC127P600X175-8N]
Q3  BC817  [SOT23-3M]
R23  value 10M  [RESC3216-1206M]  (hidden comment: RESC_1206_R)
R24  value 10M  [RESC3216-1206M]  (hidden comment: RESC_1206_R)
R25  value 10M  [RESC3216-1206M]  (hidden comment: RESC_1206_R)
R26  value 10M  [RESC3216-1206M]  (hidden comment: RESC_1206_R)
R27  value 10M  [RESC3216-1206M]  (hidden comment: RESC_1206_R)
R28  value 1M  [RESC3216-1206M]  (hidden comment: RESC_1206_R)
R29  value 130k  [RESC3216-1206M]  (hidden comment: RESC_1206_R)
R30  value 1.2k  [RESC3216-1206M]  (hidden comment: RESC_1206_R)
R31  value 5.1M  [RESC3216-1206M]  (hidden comment: RESC_1206_R)
R32  value 160k  [RESC3216-1206M]  (hidden comment: RESC_1206_R)
R33  value 40k  [RESC2012-0805M]  (hidden comment: RESC_0805_R)
R34  value 4.7k  [RESC2012-0805M]  (hidden comment: RESC_0805_R)
R35  value 0.1  [RESC2012-0805M]  (hidden comment: RESC_0805_R)
R36  value 0.1  [RESC2012-0805M]  (hidden comment: RESC_0805_R)
R37  value 10k  [RESC2012-0805M]  (hidden comment: RESC_0805_R)
R38  value 100k  [RESC2012-0805M]  (hidden comment: RESC_0805_R)
R39  value 100k  [RESC2012-0805M]  (hidden comment: RESC_0805_R)
R40  value 0.1  [RESC2012-0805M]  (hidden comment: RESC_0805_R)
R41  value 0.1  [RESC2012-0805M]  (hidden comment: RESC_0805_R)
VT1  STD2NK90ZT4  [TO228P972X240-3N]

### Ports
3.3V (out), ADC_400V, BAT (in), COUNTER, EN_400V

### Nets
3.3V: R39.1 ; port 3.3V
GND: C49.1 C50.1 C51.1 C53.1 C54.2 C55.2 PS1.4(AGND) PS1.5(PGND) Q3.2(E) R32.1 R33.2 R34.1 R35.1 R36.1 R38.1 R40.1 R41.1
VDD: C54.1 L13.1 PS1.8(VIN) ; port BAT
FB: C51.2 PS1.3(FB) R29.2 R30.2
NetC49_2: C49.2 C50.2 D1.1(K) R23.1 R31.1
NetC52_1: C52.1 PS1.2(COMP)
NetC52_2: C52.2 R34.2
NetC53_2: C53.2 PS1.1(ISEN) R35.2 R36.2 R40.2 R41.2 VT1.3(S)
NetC55_1: C55.1 HG1.2(K) R37.1
NetD1_2: D1.2(A) L13.2 VT1.4(D)
NetHG1_1: HG1.1(A) R31.2
NetJMP1_1: JMP1.1 ; port ADC_400V
NetJMP1_2: JMP1.2 R28.2 R29.1
NetPS1_6: PS1.6(DR) VT1.1(G)
NetPS1_7: PS1.7(FA/SD) R33.1 ; port EN_400V
NetQ3_1: Q3.1(B) R37.2 R38.2
NetQ3_3: Q3.3(C) R39.2 ; port COUNTER
NetR23_2: R23.2 R24.1
NetR24_2: R24.2 R25.1
NetR25_2: R25.2 R26.1
NetR26_2: R26.2 R27.1
NetR27_2: R27.2 R28.1
NetR30_1: R30.1 R32.2

### Layout directives
net class 400V: GND

### Notes on the sheet
- (near JMP1) 2,271 В при 400 В на преобразователе
- Обратная связь должна быть 1,26 В.
  Vout = 1,26*(1+(R2/R1))
  R2 = 51,13МОм
  R2 = 161,2kОм
- Мёртвое время счётчика 150-200 мкс
- Labels drawn without touching a wire or pin: GND
- (in symbol CAPC_0805) 0805
- (in symbol CAPC_1210) 1210
- (in symbol RESC_0805_R) 0805
- (in symbol RESC_1206_R) 1206

### Library data of the parts
C49 C50 = CAPC_1210: Capacitor 1210
C51-C53 C55 = CAPC_0805: Capacitor 0805
C54 = ECAP-511: Capacitor electrolytic 2.5 mm pitch, 5*11 body
D1 = M7: Diode; Manufacturer_Name: MULTICOMP; Manufacturer_Part_Number: SS34A; Datasheet Link: https://componentsearchengine.com/Datasheets/2/SS34A.pdf; Height: 2.62mm
JMP1 = JMP2.54: 2.54mm single jumper
L13 = SDR1006-220ML: Connector; Manufacturer_Name: Bourns; Allied_Number: 70154258; Datasheet Link: https://www.mouser.com/datasheet/2/54/DR1006-1391503.pdf; Height: 5.8mm; Manufacturer_Part_Number: SDR1006-220ML; Mouser Part Number: 652-SDR1006-220ML; Mouser Price/Stock: https://www.mouser.com/Search/Refine.aspx?Keyword=652-SDR1006-220ML; RS Part Number: 7361349P; RS Price/Stock: http://uk.rs-online.com/web/p/products/7361349P; Allied Price/Stock: https://www.alliedelec.com/bourns-sdr1006-220ml/70154258/
PS1 = LM3478MA_NOPB: Power Supply; Manufacturer_Name: Texas Instruments; Manufacturer_Part_Number: LM3478MA/NOPB; Datasheet Link: http://www.ti.com/lit/gpn/lm3478; Height: 1.75mm; Mouser Part Number: 926-LM3478MA/NOPB; Mouser Price/Stock: https://www.mouser.com/Search/Refine.aspx?Keyword=926-LM3478MA%2FNOPB; RS Part Number: 8115560P; RS Price/Stock: http://uk.rs-online.com/web/p/products/8115560P
Q3 = BC817: BC817 NPN Transistor
R23-R32 = RESC_1206_R: Resistor 1206
R33-R41 = RESC_0805_R: Resistor 0805
VT1 = STD2NK90ZT4: Integrated Circuit; Manufacturer_Name: STMicroelectronics; Allied_Number: 70390747; Datasheet Link: http://docs-emea.rs-online.com/webdocs/0dbf/0900766b80dbfe4f.pdf; Height: 2.4mm; Manufacturer_Part_Number: STD2NK90ZT4; Mouser Part Number: 511-STD2NK90Z; Mouser Price/Stock: https://www.mouser.com/Search/Refine.aspx?Keyword=511-STD2NK90Z; RS Part Number: 6875100P; RS Price/Stock: http://uk.rs-online.com/web/p/products/6875100P; Allied Price/Stock: http://www.alliedelec.com/stmicroelectronics-std2nk90zt4/70390747/

## Nets that join several sheets
3.3V: Battery_Control (5 pins), MCU_RF (20 pins), Geiger_Pwr_LM3478 (R39.1)
GND: Battery_Control (24 pins), MCU_RF (64 pins), Geiger_Pwr_LM3478 (17 pins)
VDD: Battery_Control (10 pins), Geiger_Pwr_LM3478 (C54.1 L13.1 PS1.8)
NetC5_2: Battery_Control (C5.2 R3.1 R5.2), MCU_RF (U4.C4)
NetIC3_1: Battery_Control (IC3.1), MCU_RF (U4.C6)
NetJMP1_1: MCU_RF (U4.F3), Geiger_Pwr_LM3478 (JMP1.1)
NetPS1_7: MCU_RF (U4.F6), Geiger_Pwr_LM3478 (PS1.7 R33.1)
NetQ3_3: MCU_RF (U4.E4), Geiger_Pwr_LM3478 (Q3.3 R39.2)
USB_N: Battery_Control (U3.4), MCU_RF (U4.B8)
USB_P: Battery_Control (U3.6), MCU_RF (U4.C8)